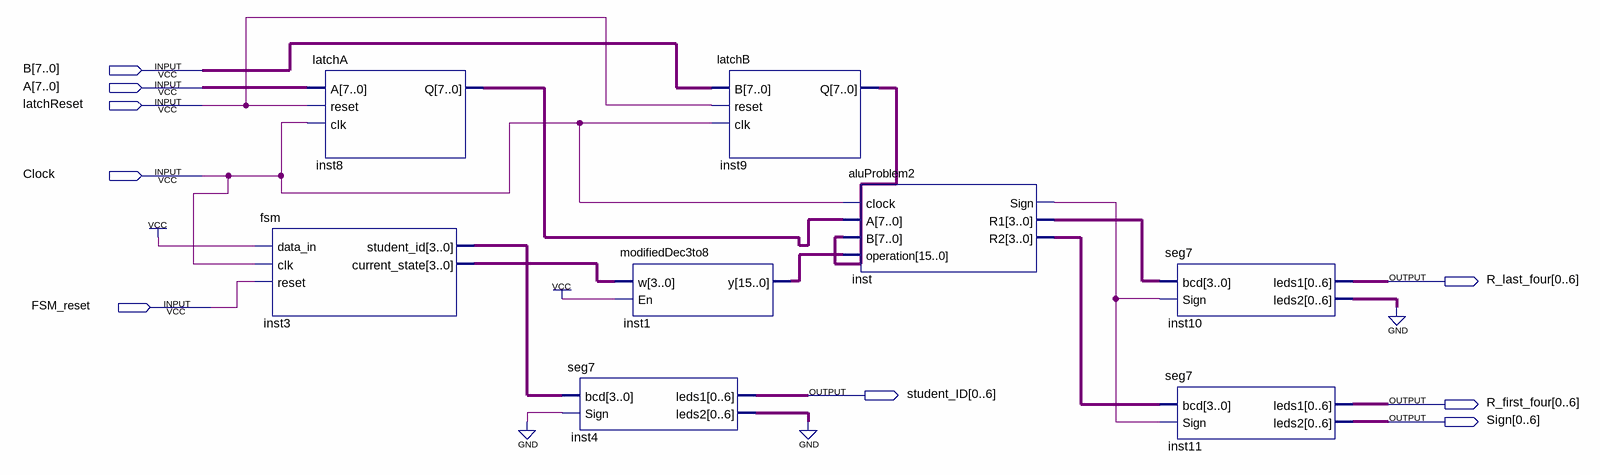
[diagram p0: schematic sheet]
// Quartus schematic problem2.bdf as structural Verilog: 8 symbols, 9 pins
module problem2 (
  input  [7:0] B,
  input  [7:0] A,
  input  latchReset,
  input  Clock,
  input  FSM_reset,
  output [0:6] R_last_four,
  output [0:6] student_ID,
  output [0:6] R_first_four,
  output [0:6] Sign
);

  wire inst_sign;
  wire [3:0] inst3_current_state, inst3_student_id, inst_r1, inst_r2;
  wire [6:0] inst4_leds2, inst10_leds2;
  wire [7:0] inst8_q, inst9_q;
  wire [15:0] inst1_y;

  fsm inst3 (
    .data_in(1'b1), .clk(Clock), .reset(FSM_reset), .student_id(inst3_student_id),
    .current_state(inst3_current_state));
  latchA inst8 (.A(A), .reset(latchReset), .clk(Clock), .Q(inst8_q));
  seg7 inst4 (.bcd(inst3_student_id), .Sign(1'b0), .leds1(student_ID), .leds2(inst4_leds2));
  modifiedDec3to8 inst1 (.w(inst3_current_state), .En(1'b1), .y(inst1_y));
  latchB inst9 (.B(B), .reset(latchReset), .clk(Clock), .Q(inst9_q));
  aluProblem2 inst (
    .clock(Clock), .A(inst8_q), .B(inst9_q), .operation(inst1_y), .Sign(inst_sign), .R1(inst_r1), .R2(inst_r2));
  seg7 inst10 (.bcd(inst_r1), .Sign(inst_sign), .leds1(R_last_four), .leds2(inst10_leds2));
  seg7 inst11 (.bcd(inst_r2), .Sign(inst_sign), .leds1(R_first_four), .leds2(Sign));
  // also tied to GND on the sheet: {inst4_leds2[0], inst4_leds2[1], inst4_leds2[2], inst4_leds2[3], inst4_leds2[4], inst4_leds2[5], inst4_leds2[6], inst10_leds2[0], inst10_leds2[1], inst10_leds2[2], inst10_leds2[3], inst10_leds2[4], inst10_leds2[5], inst10_leds2[6]}
endmodule
